# EAGLE design followers_v1 (EAGLE 9.5.0)

## Sheet 1 of 6: Input Amplifier
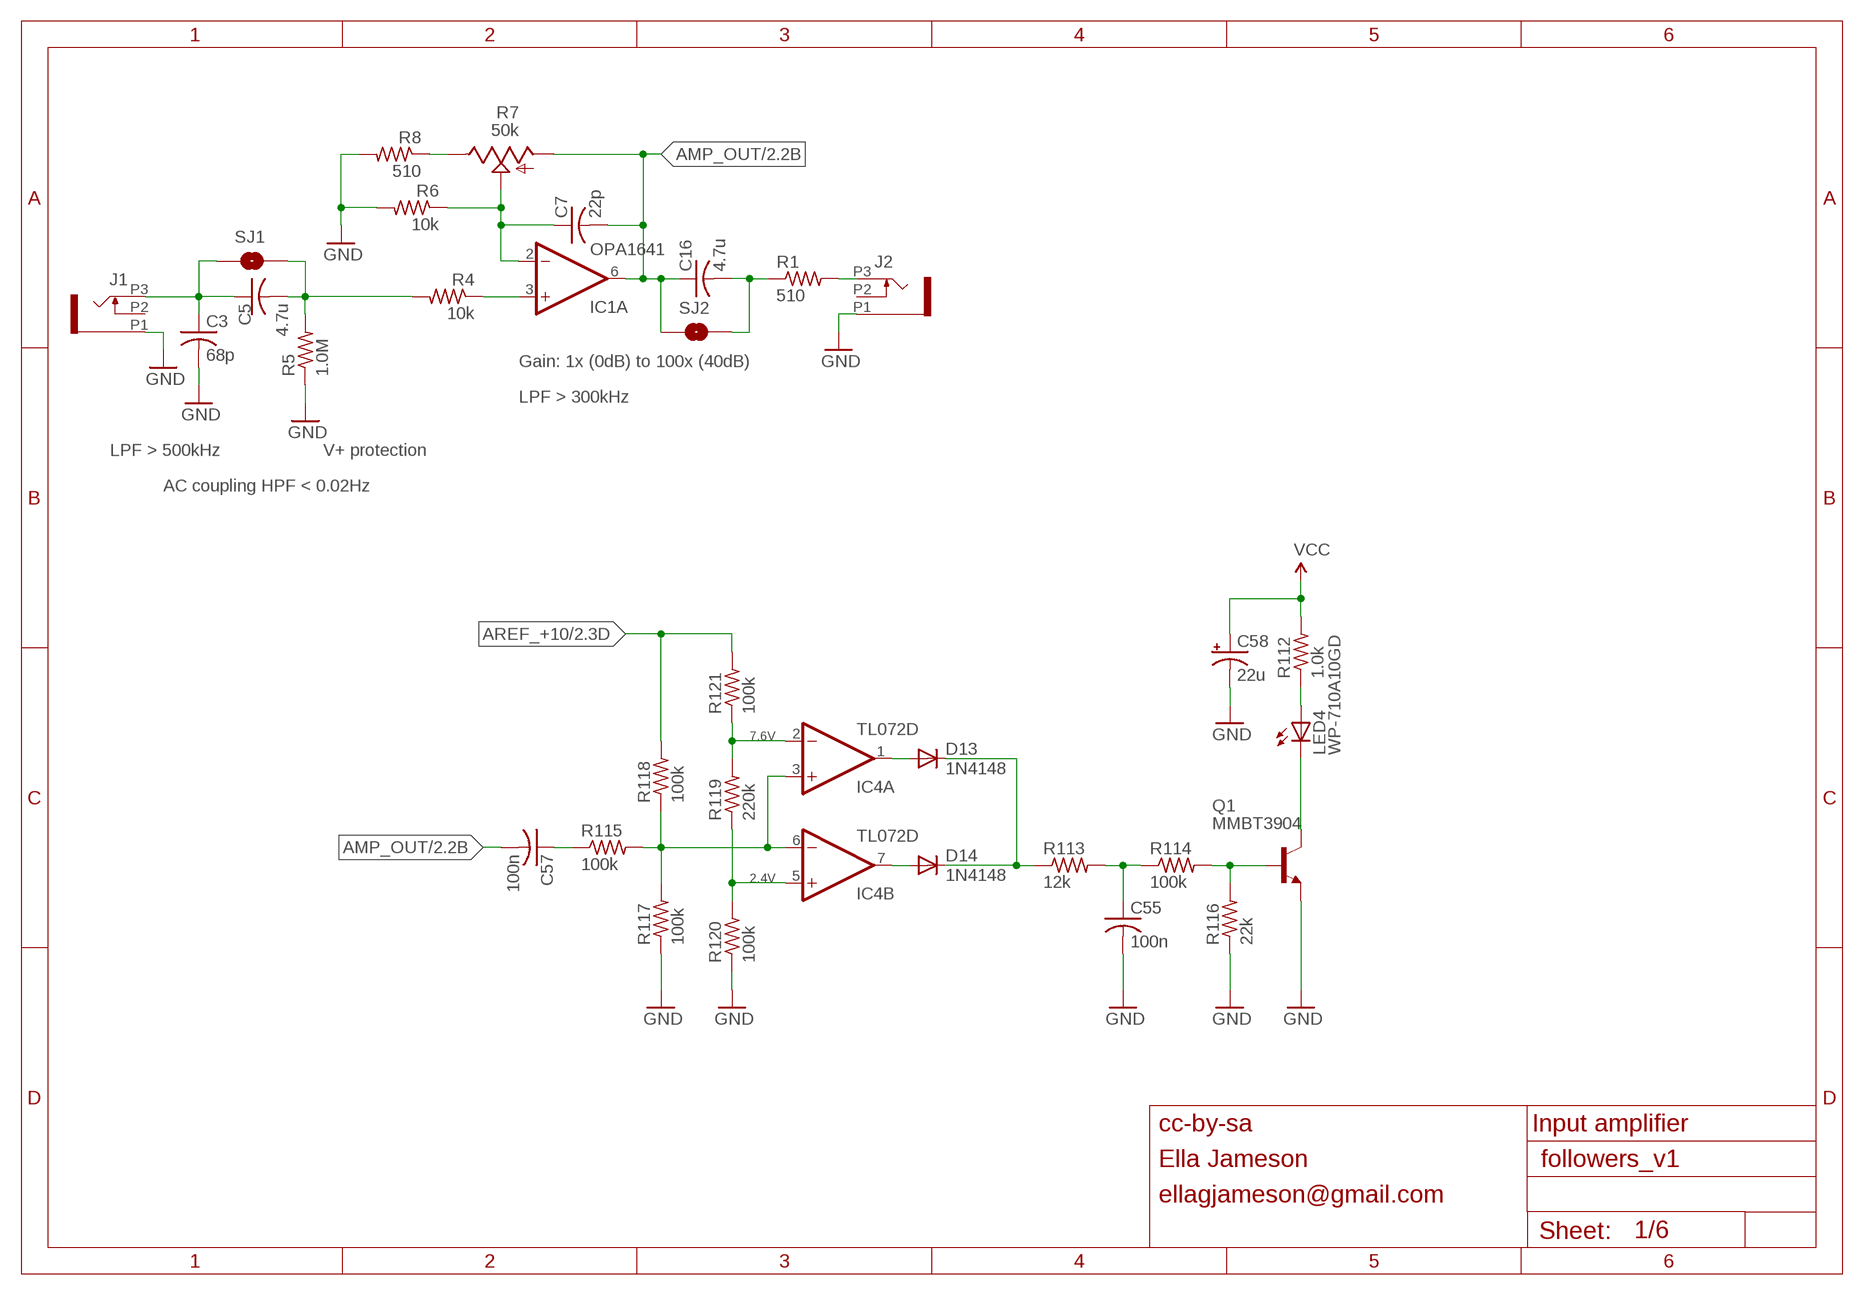
[diagram p0: schematic, sheet 1]

### Parts
C3  68p  C-USC0402  [C0402]
C5  4.7u  C-USC0603  [C0603]
C7  22p  C-USC0402  [C0402]
C16  4.7u  C-USC0603  [C0603]
C55  100n  C-USC0603  [C0603]
C57  100n  C-USC0603  [C0603]
C58  22u  CPOL-USC  [PANASONIC_C]
D13  1N4148  DIODE-SOD323-W  [SOD323-W]
D14  1N4148  DIODE-SOD323-W  [SOD323-W]
IC1  OPA1641  [MSOP8]
IC4  TL072D  [SO08]
J1  PJ301_THONKICONN6  [WQP_PJ_301M6]
J2  PJ301_THONKICONN6  [WQP_PJ_301M6]
LED4  WP-710A10GD  LED3MM  [LED3MM]
Q1  MMBT3904  MMBT3904LT1-NPN-SOT23-BEC  [SOT23-BEC]
R1  510  R-US_R0402  [R0402]
R4  10k  R-US_R0402  [R0402]
R5  1.0M  R-US_R0402  [R0402]
R6  10k  R-US_R0402  [R0402]
R7  50k  POT_USVERTICAL_PS  [ALPS_POT_VERTICAL_PS]
R8  510  R-US_R0402  [R0402]
R112  1.0k  R-US_R0603  [R0603]
R113  12k  R-US_R0603  [R0603]
R114  100k  R-US_R0603  [R0603]
R115  100k  R-US_R0603  [R0603]
R116  22k  R-US_R0603  [R0603]
R117  100k  R-US_R0603  [R0603]
R118  100k  R-US_R0603  [R0603]
R119  220k  R-US_R0603  [R0603]
R120  100k  R-US_R0603  [R0603]
R121  100k  R-US_R0603  [R0603]
SJ1  SOLDERJUMPERNC  [SJ_2S]
SJ2  SOLDERJUMPERNC  [SJ_2S]

### Nets
AMP_OUT: C7.2 C16.1 C57.2 IC1.6(A:OUT) R7.P$3(A) SJ2.1 ; also sheet 2
AREF_+10: R118.2 R121.2 ; also sheet 2,6
GND: C3.2 C55.2 C58.- J1.P1 J2.P1 Q1.E R5.1 R6.2 R8.2 R116.1 R117.1 R120.1 ; also sheet 2,3,4,5,6
N$2: IC1.3(A:+IN) R4.1
N$3: J2.P3 R1.2
N$4: C3.1 C5.1 J1.P3 SJ1.1
N$9: C7.1 IC1.2(A:-IN) R6.1 R7.P$2(S)
N$10: C5.2 R4.2 R5.2 SJ1.2
N$13: R7.P$1(E) R8.1
N$15: C16.2 R1.1 SJ2.2
N$60: LED4.K(C) Q1.C
N$94: C57.1 R115.1
N$96: IC4.3(A:+IN) IC4.6(B:-IN) R115.2 R117.2 R118.1
N$97: IC4.2(A:-IN) R119.2 R121.1
N$98: C55.1 R113.2 R114.1
N$99: IC4.5(B:+IN) R119.1 R120.2
N$100: D13.A IC4.1(A:OUT)
N$101: D14.A IC4.7(B:OUT)
N$102: D13.C D14.C R113.1
N$103: LED4.A R112.1
N$104: Q1.B R114.2 R116.2
VCC: C58.+ R112.2 ; also sheet 6
Unconnected: J1.P2 J2.P2

### Notes on the sheet
- Gain: 1x (0dB) to 100x (40dB)
- LPF > 300kHz
- LPF > 500kHz | V+ protection
- AC coupling HPF < 0.02Hz
- 7.6V
- 2.4V
- cc-by-sa | Input amplifier
- Ella Jameson
- ellagjameson@gmail.com

## Sheet 2 of 6: Full Wave Rectifier
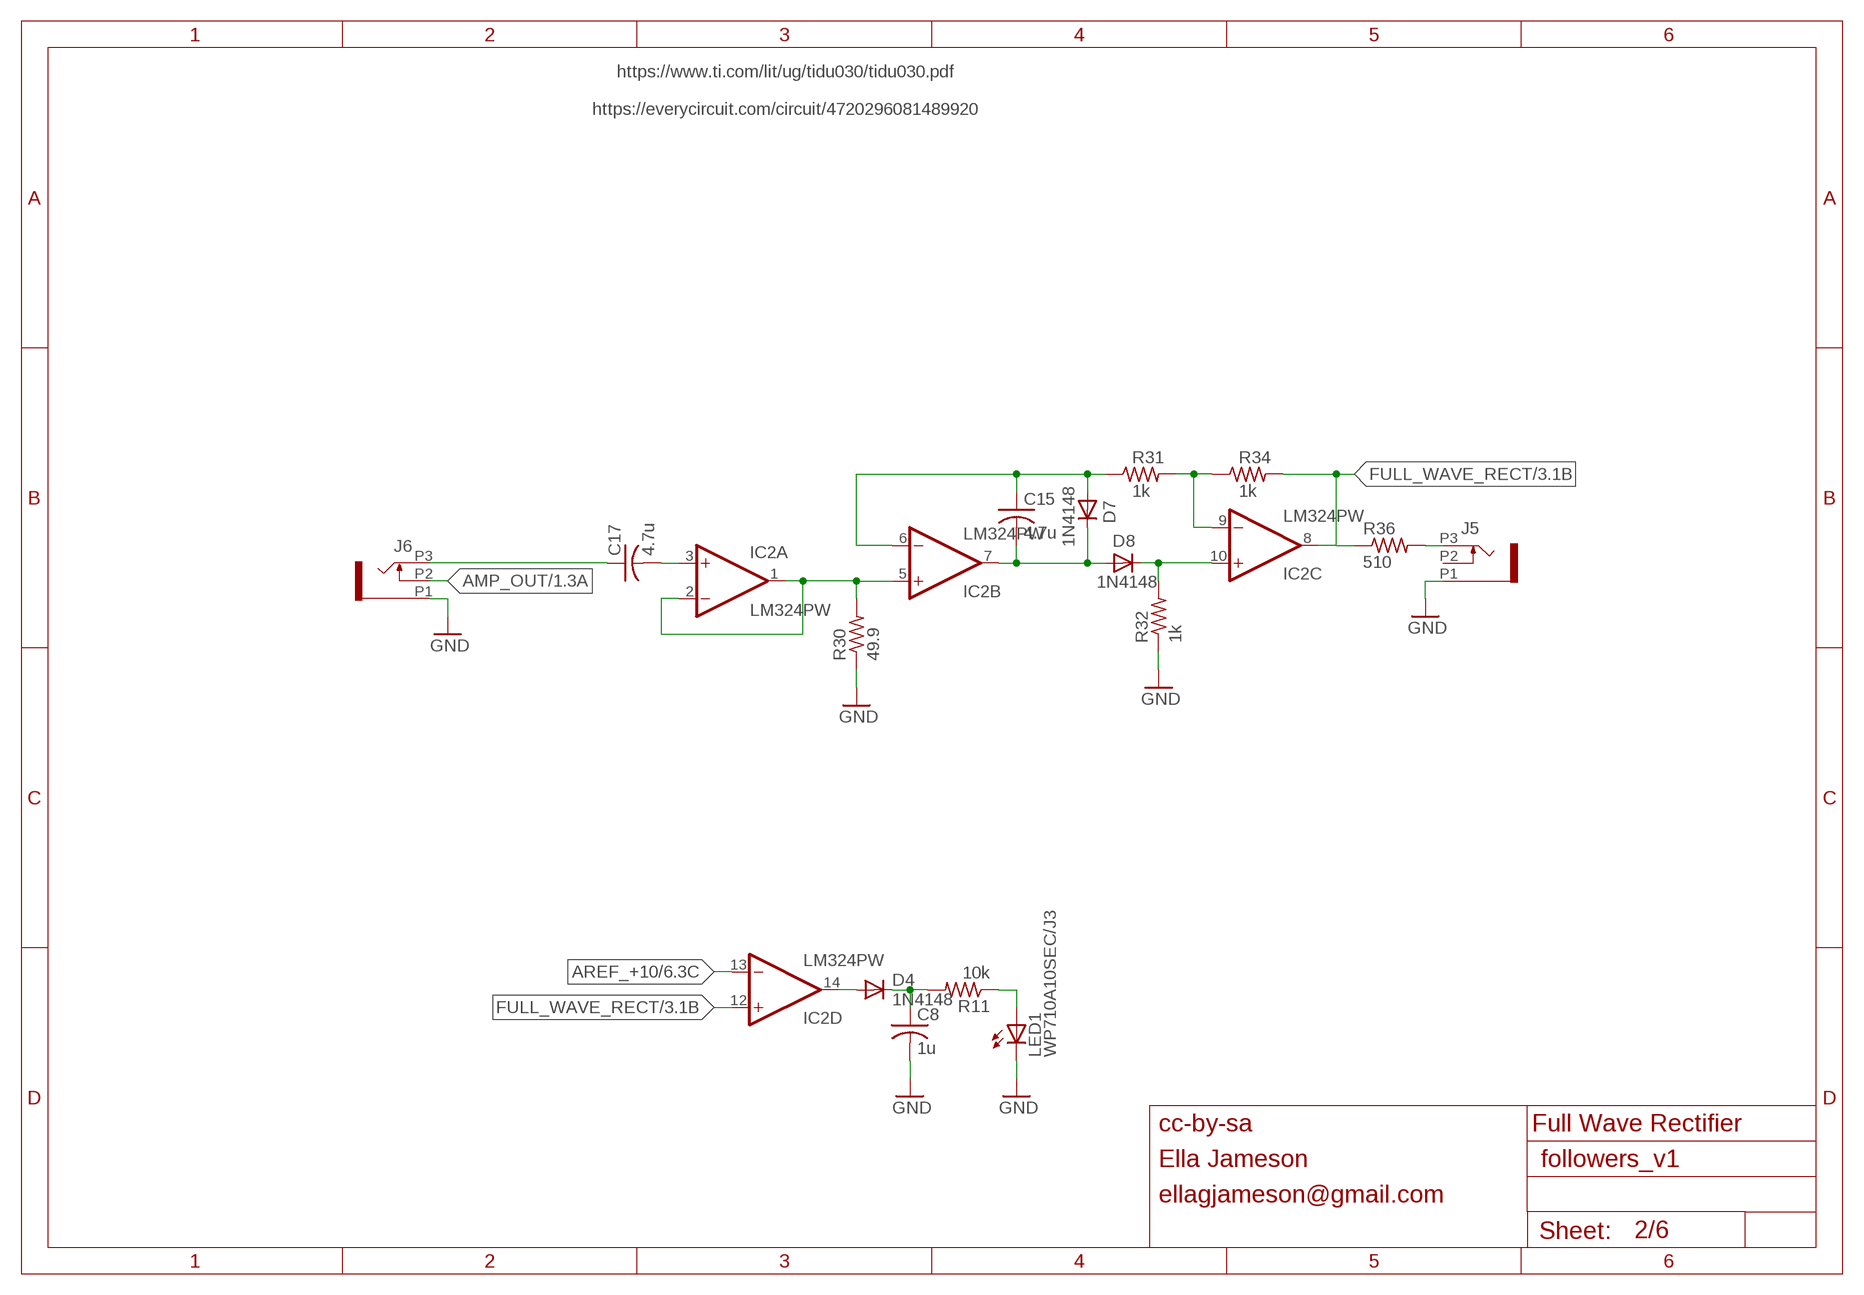
[diagram p1: schematic, sheet 2]

### Parts
C8  1u  C-USC0402  [C0402]
C15  4.7u  C-USC0603  [C0603]
C17  4.7u  C-USC0603  [C0603]
D4  1N4148  DIODE-SOD523  [SOD523]
D7  1N4148  DIODE-SOD523  [SOD523]
D8  1N4148  DIODE-SOD523  [SOD523]
IC2  LM324PW  [TSSOP14]
J5  PJ301_THONKICONN6  [WQP_PJ_301M6]
J6  PJ301_THONKICONN6  [WQP_PJ_301M6]
LED1  WP710A10SEC/J3  LED3MM  [LED3MM]
R11  10k  R-US_R0402  [R0402]
R30  49.9  R-US_R0402  [R0402]
R31  1k  R-US_R0402  [R0402]
R32  1k  R-US_R0402  [R0402]
R34  1k  R-US_R0402  [R0402]
R36  510  R-US_R0402  [R0402]

### Nets
AMP_OUT: J6.P2 ; also sheet 1
AREF_+10: IC2.13(D:-IN) ; also sheet 1,6
FULL_WAVE_RECT: IC2.8(C:OUT) IC2.12(D:+IN) R34.2 R36.1 ; also sheet 3
FWR_CLIP: D4.A IC2.14(D:OUT)
GND: C8.2 J5.P1 J6.P1 LED1.K(C) R30.1 R32.1 ; also sheet 1,3,4,5,6
N$5: C15.2 D7.C D8.A IC2.7(B:OUT)
N$7: J5.P3 R36.2
N$11: C15.1 D7.A IC2.6(B:-IN) R31.1
N$12: D8.C IC2.10(C:+IN) R32.2
N$14: IC2.9(C:-IN) R31.2 R34.1
N$27: C17.1 J6.P3
N$28: C8.1 D4.C R11.2
N$31: LED1.A R11.1
N$32: C17.2 IC2.3(A:+IN)
N$33: IC2.1(A:OUT) IC2.2(A:-IN) IC2.5(B:+IN) R30.2
Unconnected: J5.P2

### Notes on the sheet
- https://www.ti.com/lit/ug/tidu030/tidu030.pdf
  
  https://everycircuit.com/circuit/4720296081489920
- cc-by-sa | Full Wave Rectifier
- Ella Jameson
- ellagjameson@gmail.com

## Sheet 3 of 6: Slew Rate Limiter
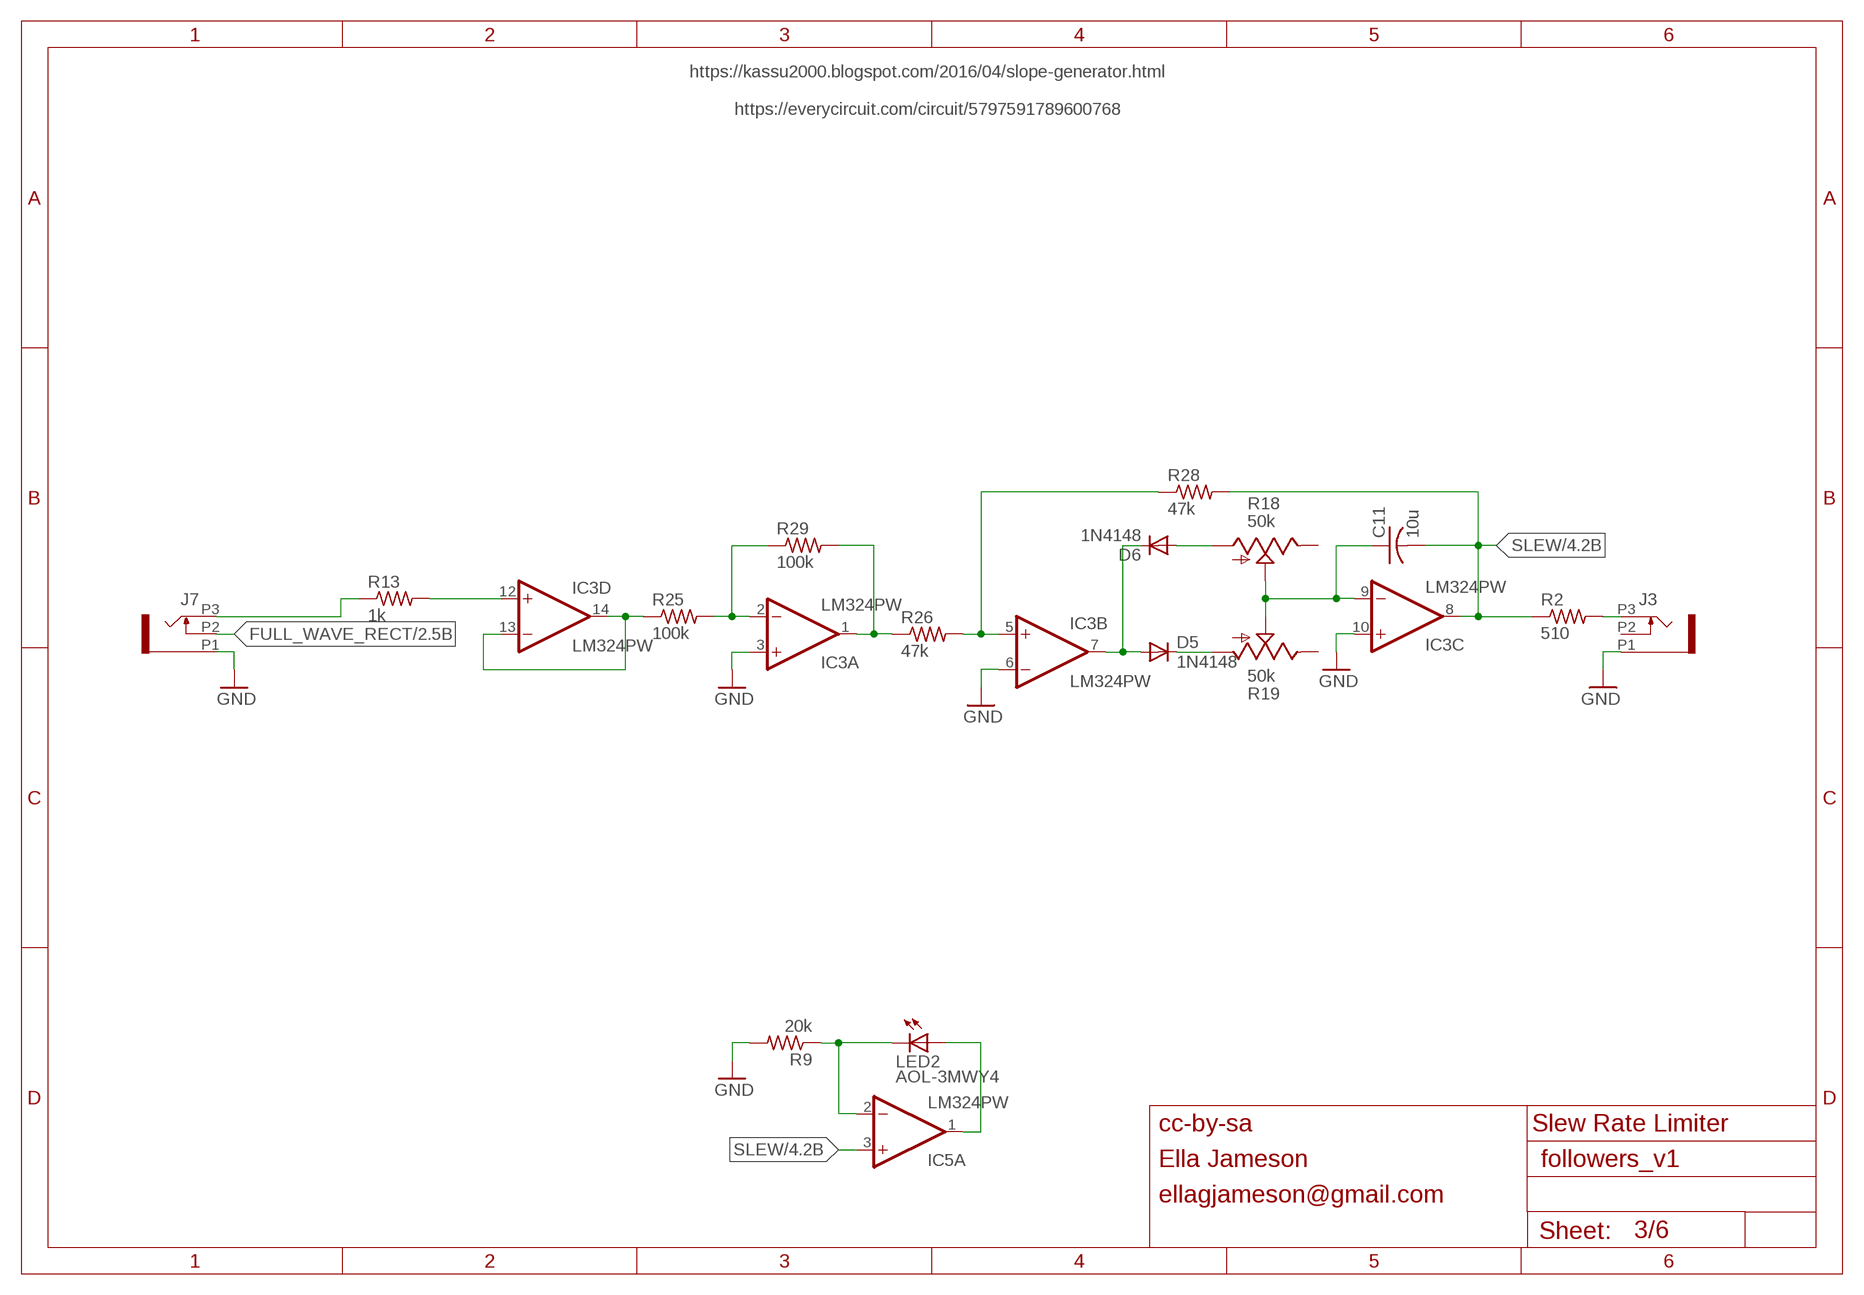
[diagram p2: schematic, sheet 3]

### Parts
C11  10u  C-USC0402  [C0402]
D5  1N4148  DIODE-SOD523  [SOD523]
D6  1N4148  DIODE-SOD523  [SOD523]
IC3  LM324PW  [TSSOP14]
IC5  LM324PW  [TSSOP14]
J3  PJ301_THONKICONN6  [WQP_PJ_301M6]
J7  PJ301_THONKICONN6  [WQP_PJ_301M6]
LED2  AOL-3MWY4  LED3MM  [LED3MM]
R2  510  R-US_R0402  [R0402]
R9  20k  R-US_R0402  [R0402]
R13  1k  R-US_R0402  [R0402]
R18  50k  POT_USVERTICAL_PS  [ALPS_POT_VERTICAL_PS]
R19  50k  POT_USVERTICAL_PS  [ALPS_POT_VERTICAL_PS]
R25  100k  R-US_R0402  [R0402]
R26  47k  R-US_R0402  [R0402]
R28  47k  R-US_R0402  [R0402]
R29  100k  R-US_R0402  [R0402]

### Nets
FULL_WAVE_RECT: J7.P2 ; also sheet 2
GND: IC3.3(A:+IN) IC3.6(B:-IN) IC3.10(C:+IN) J3.P1 J7.P1 R9.2 ; also sheet 1,2,4,5,6
N$1: J7.P3 R13.1
N$8: IC3.13(D:-IN) IC3.14(D:OUT) R25.1
N$16: J3.P3 R2.2
N$17: IC5.2(A:-IN) LED2.K(C) R9.1
N$18: IC3.2(A:-IN) R25.2 R29.1
N$19: IC3.1(A:OUT) R26.1 R29.2
N$21: IC3.5(B:+IN) R26.2 R28.1
N$23: D5.A D6.C IC3.7(B:OUT)
N$24: D5.C R19.P$3(A)
N$25: D6.A R18.P$3(A)
N$26: C11.1 IC3.9(C:-IN) R18.P$2(S) R19.P$2(S)
N$29: IC3.12(D:+IN) R13.2
N$30: IC5.1(A:OUT) LED2.A
SLEW: C11.2 IC3.8(C:OUT) IC5.3(A:+IN) R2.1 R28.2 ; also sheet 4
Unconnected: J3.P2 R18.P$1(E) R19.P$1(E)

### Notes on the sheet
- https://kassu2000.blogspot.com/2016/04/slope-generator.html
  
  https://everycircuit.com/circuit/5797591789600768
- cc-by-sa | Slew Rate Limiter
- Ella Jameson
- ellagjameson@gmail.com

## Sheet 4 of 6: Lowpass Filter
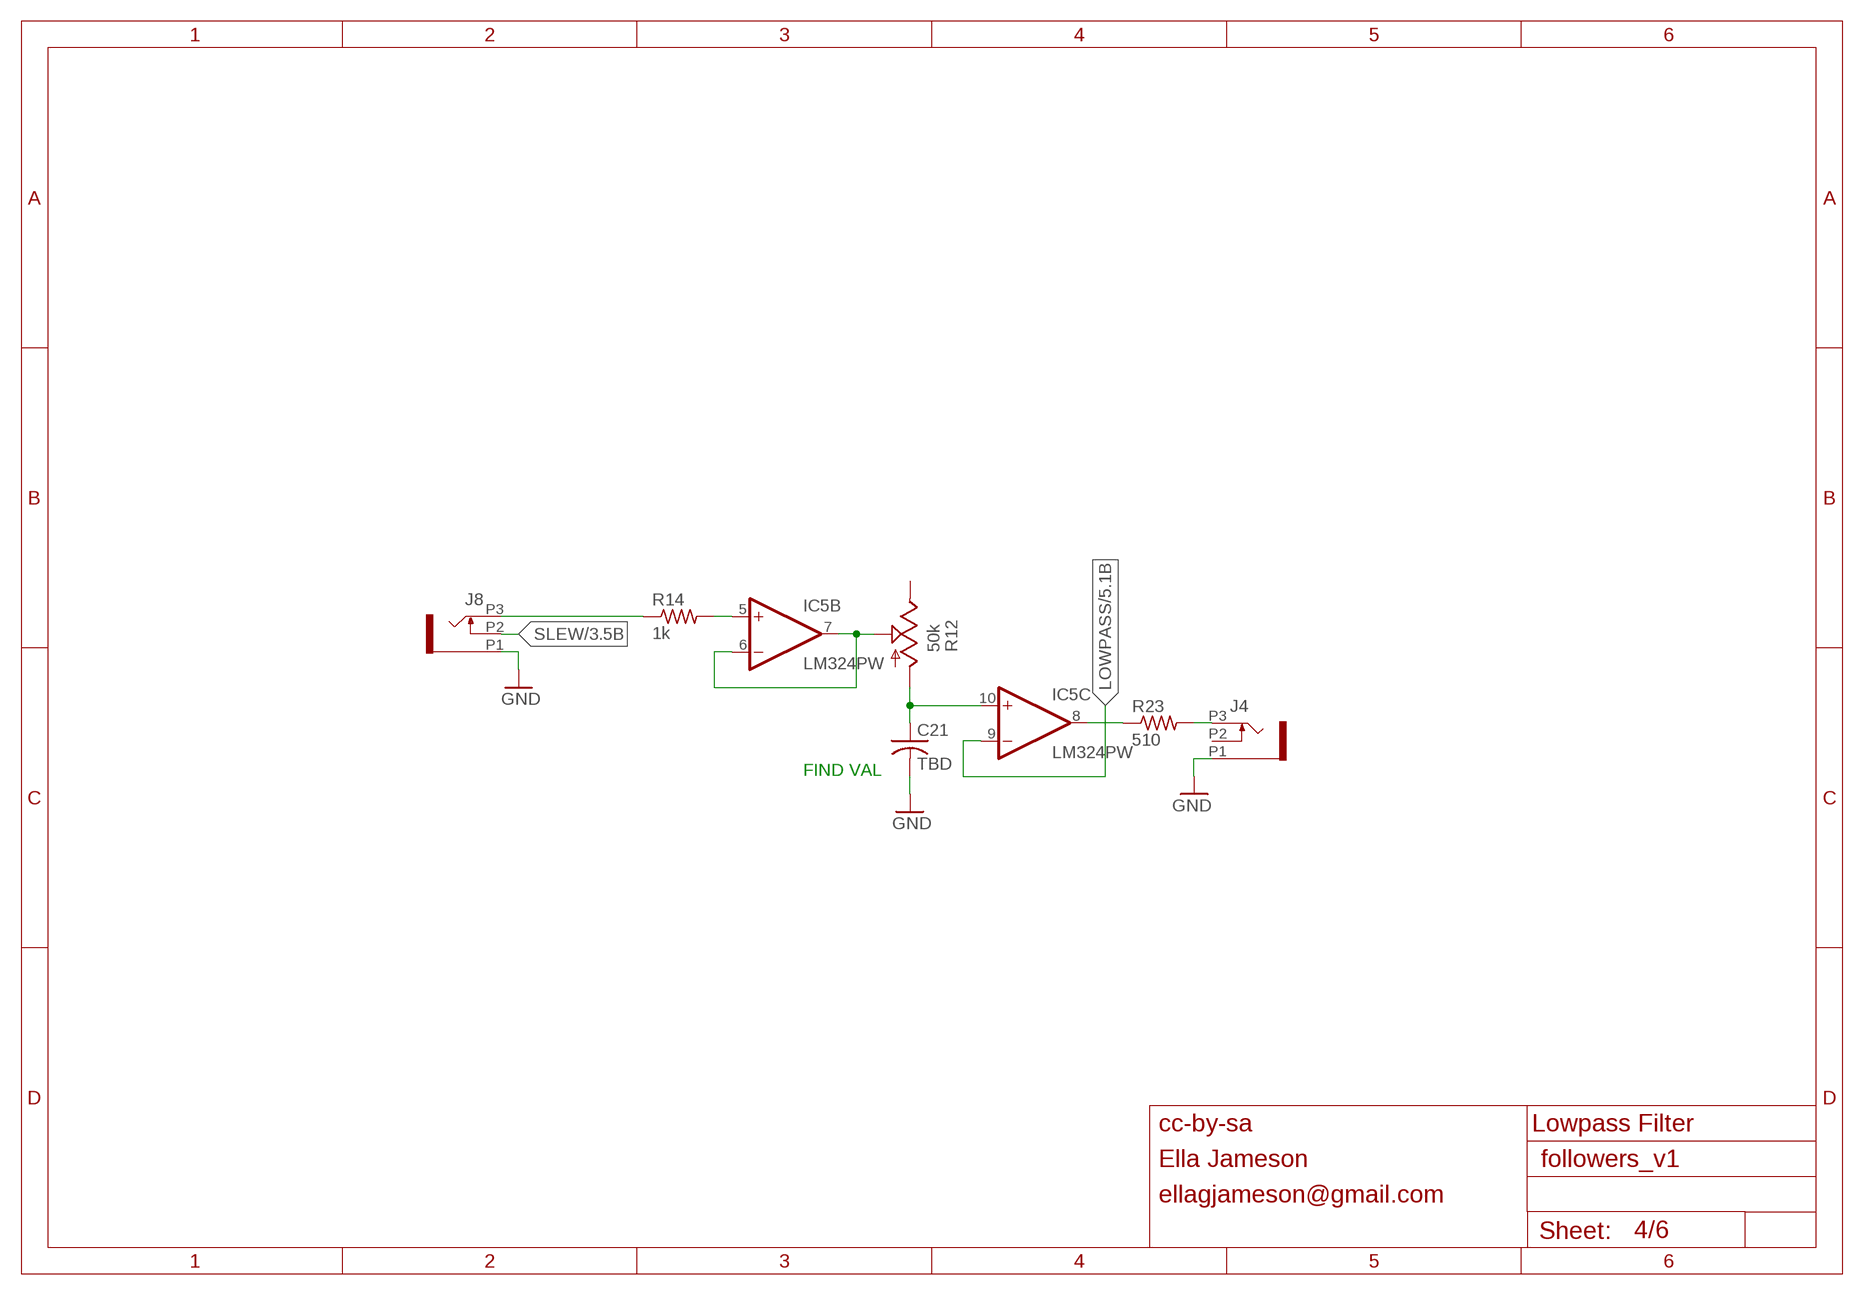
[diagram p3: schematic, sheet 4]

### Parts
C21  TBD  C-USC0402  [C0402]
J4  PJ301_THONKICONN6  [WQP_PJ_301M6]
J8  PJ301_THONKICONN6  [WQP_PJ_301M6]
R12  50k  POT_USVERTICAL_PS  [ALPS_POT_VERTICAL_PS]
R14  1k  R-US_R0402  [R0402]
R23  510  R-US_R0402  [R0402]

### Nets
GND: C21.2 J4.P1 J8.P1 ; also sheet 1,2,3,5,6
LOWPASS: IC5.8(C:OUT) IC5.9(C:-IN) R23.1 ; also sheet 5
N$35: C21.1 IC5.10(C:+IN) R12.P$3(A)
N$36: IC5.5(B:+IN) R14.2
N$39: J8.P3 R14.1
N$40: J4.P3 R23.2
N$43: IC5.6(B:-IN) IC5.7(B:OUT) R12.P$2(S)
SLEW: J8.P2 ; also sheet 3
Unconnected: J4.P2 R12.P$1(E)

### Notes on the sheet
- FIND VAL
- cc-by-sa | Lowpass Filter
- Ella Jameson
- ellagjameson@gmail.com

## Sheet 5 of 6: Comparator
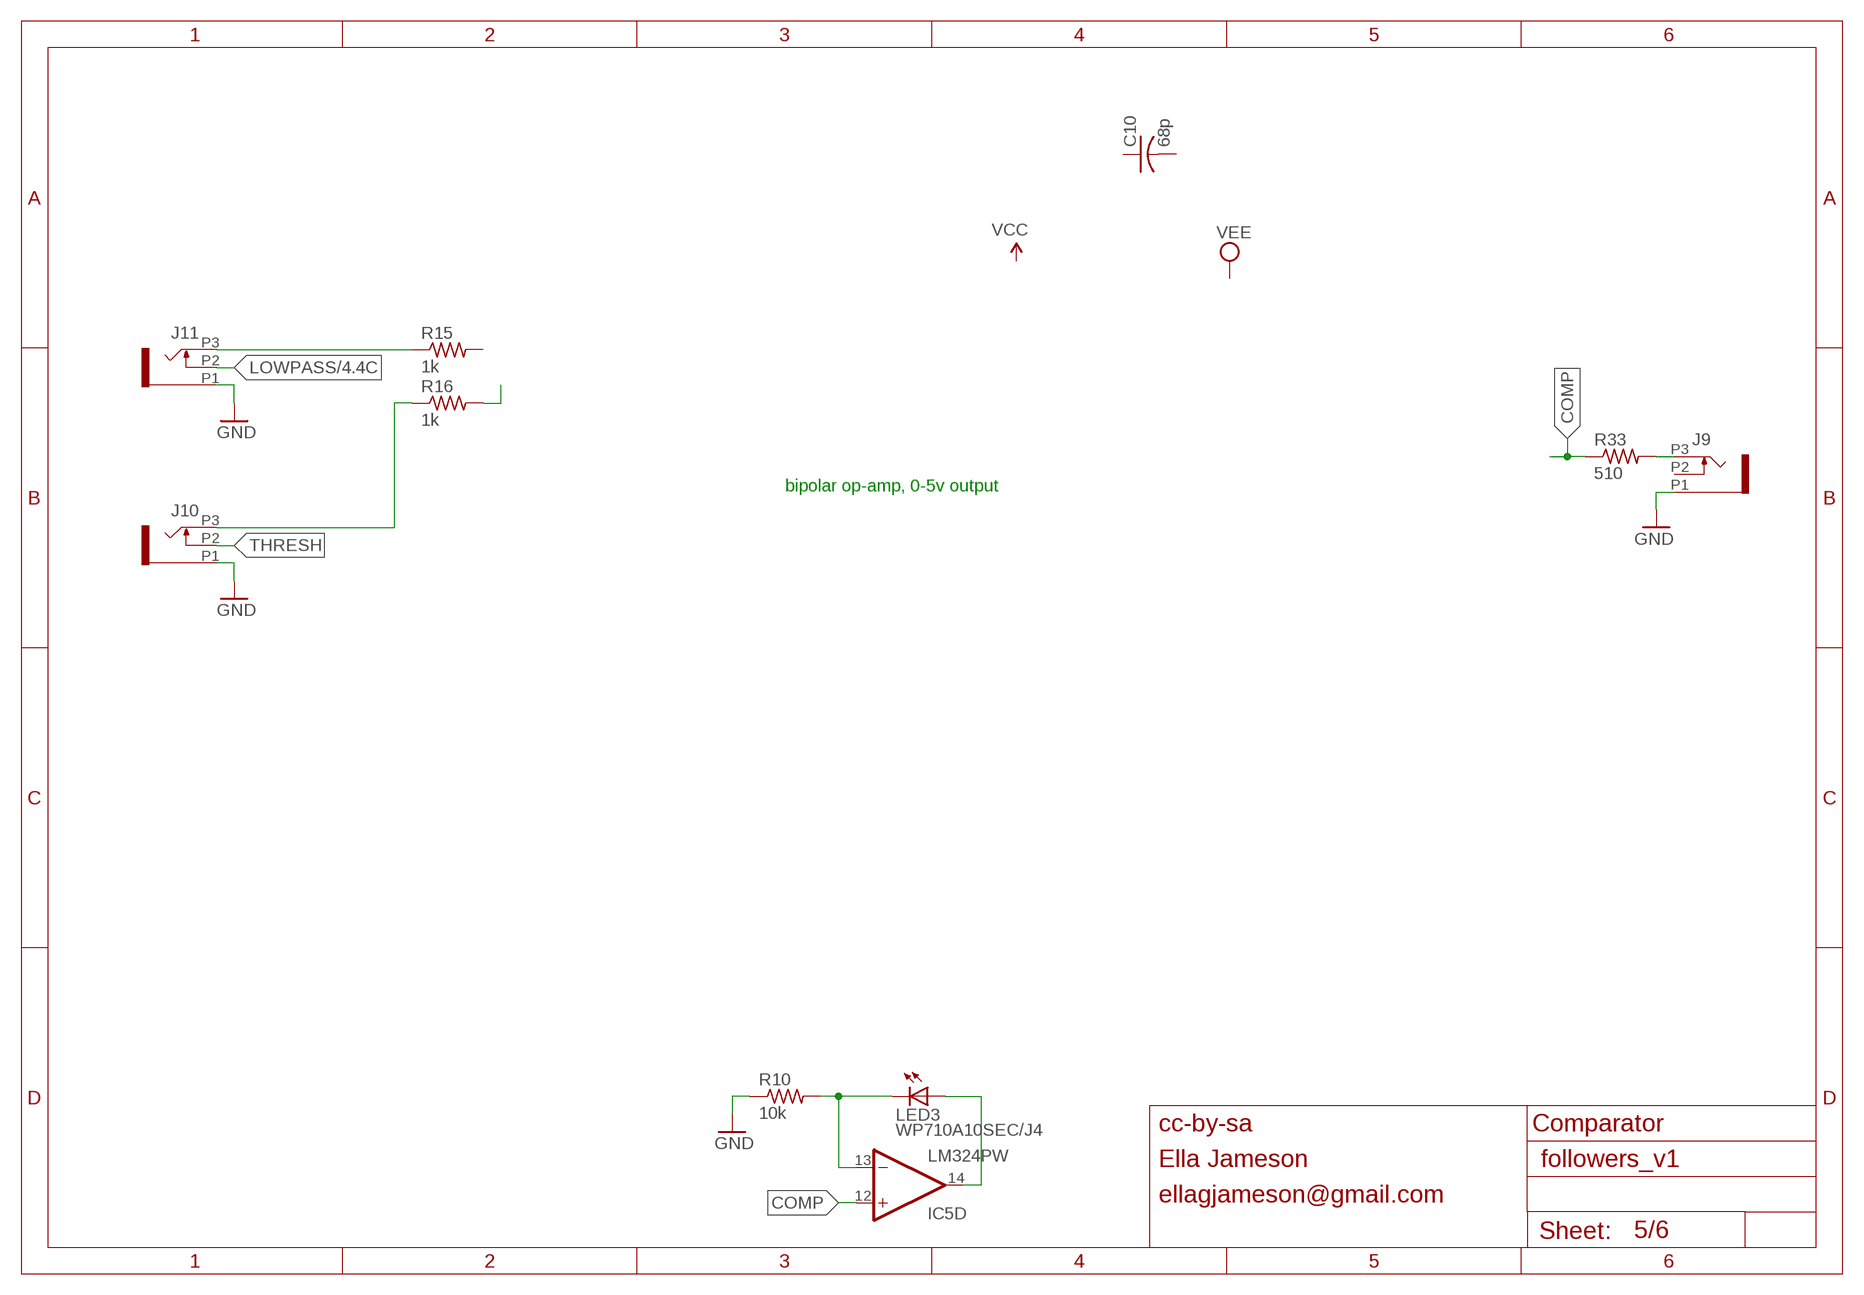
[diagram p4: schematic, sheet 5]

### Parts
C10  68p  C-USC0402  [C0402]
J9  PJ301_THONKICONN6  [WQP_PJ_301M6]
J10  PJ301_THONKICONN6  [WQP_PJ_301M6]
J11  PJ301_THONKICONN6  [WQP_PJ_301M6]
LED3  WP710A10SEC/J4  LED3MM  [LED3MM]
R10  10k  R-US_R0402  [R0402]
R15  1k  R-US_R0402  [R0402]
R16  1k  R-US_R0402  [R0402]
R33  510  R-US_R0402  [R0402]

### Nets
COMP: IC5.12(D:+IN) R33.1
GND: J9.P1 J10.P1 J11.P1 R10.1 ; also sheet 1,2,3,4,6
LOWPASS: J11.P2 ; also sheet 4
N$34: J9.P3 R33.2
N$37: IC5.13(D:-IN) LED3.K(C) R10.2
N$38: IC5.14(D:OUT) LED3.A
N$41: J11.P3 R15.1
N$42: J10.P3 R16.1
N$45: R16.2
THRESH: J10.P2
Unconnected: C10.1 C10.2 J9.P2 R15.2

### Notes on the sheet
- bipolar op-amp, 0-5v output
- cc-by-sa | Comparator
- Ella Jameson
- ellagjameson@gmail.com

## Sheet 6 of 6: Power Supply
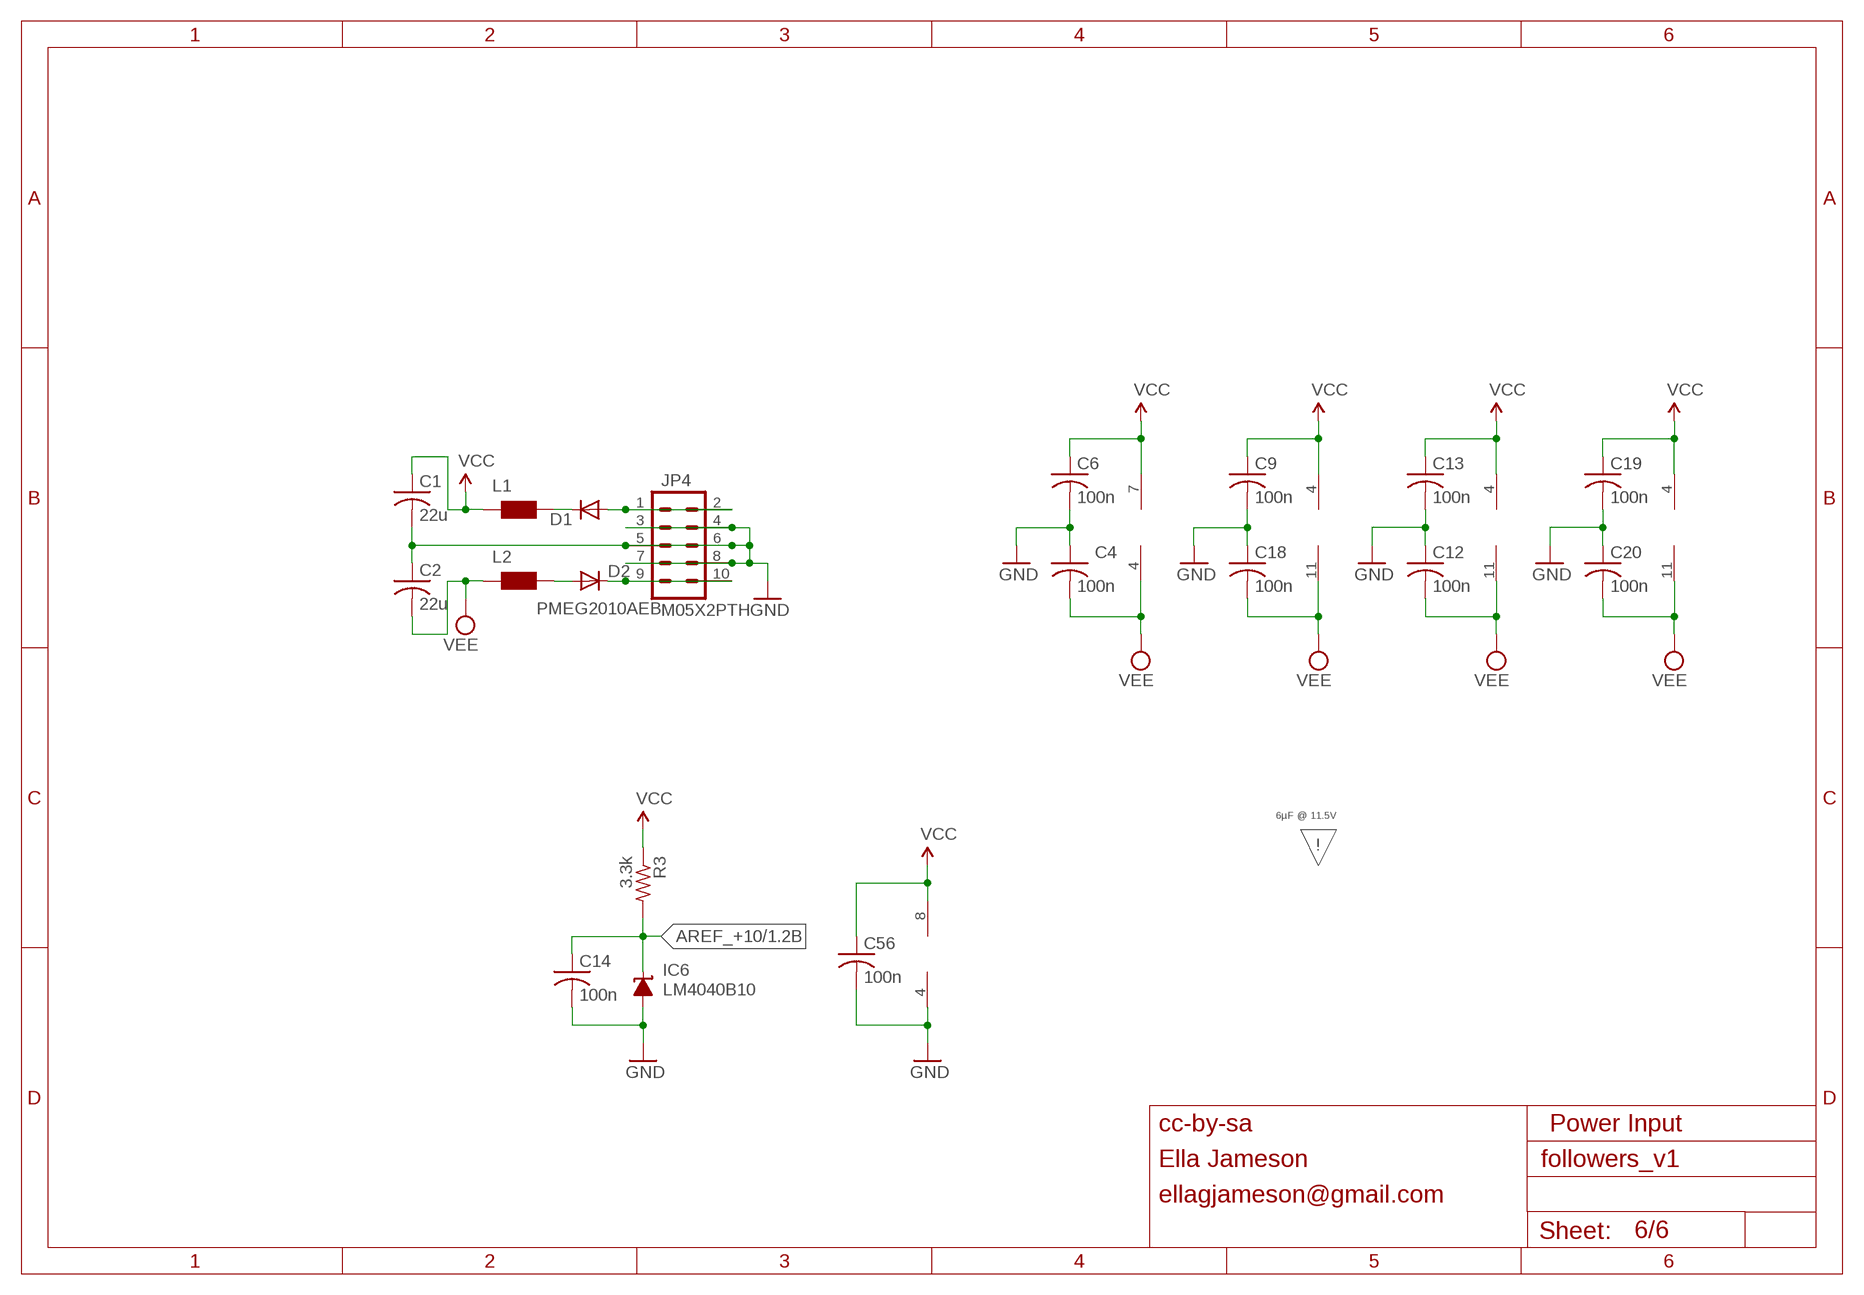
[diagram p5: schematic, sheet 6]

### Parts
C1  22u  C-USC1206  [C1206]
C2  22u  C-USC1206  [C1206]
C4  100n  C-USC0402  [C0402]
C6  100n  C-USC0402  [C0402]
C9  100n  C-USC0402  [C0402]
C12  100n  C-USC0402  [C0402]
C13  100n  C-USC0402  [C0402]
C14  100n  C-USC0603  [C0603]
C18  100n  C-USC0402  [C0402]
C19  100n  C-USC0402  [C0402]
C20  100n  C-USC0402  [C0402]
C56  100n  C-USC0603  [C0603]
D1  PMEG2010AEB  DIODE-SOD523  [SOD523]
D2  PMEG2010AEB  DIODE-SOD523  [SOD523]
IC6  LM4040B10  LM4041B12DBZ  [DBZ_R-PDSO-G3]
JP4  M05X2PTH  [AVR_ICSP]
L1  WE-CBF_0603  [0603]
L2  WE-CBF_0603  [0603]
R3  3.3k  R-US_R0603  [R0603]

### Nets
AREF_+10: C14.1 IC6.1(C) R3.2 ; also sheet 1,2
GND: C1.2 C2.1 C4.1 C6.2 C9.2 C12.1 C13.2 C14.2 C18.1 C19.2 C20.1 C56.2 IC4.4(P:V-) IC6.2(A) JP4.3 JP4.4 JP4.5 JP4.6 JP4.7 JP4.8 ; also sheet 1,2,3,4,5
N$6: D1.A JP4.1 JP4.2
N$20: D2.C JP4.9 JP4.10
N$22: D1.C L1.2
N$44: D2.A L2.2
VCC: C1.1 C6.1 C9.1 C13.1 C19.1 C56.1 IC1.7(V+) IC2.4(P:V+) IC3.4(P:V+) IC4.8(P:V+) IC5.4(P:V+) L1.1 R3.1 ; also sheet 1
VEE: C2.2 C4.2 C12.2 C18.2 C20.2 IC1.4(V-) IC2.11(P:V-) IC3.11(P:V-) IC5.11(P:V-) L2.1

### Notes on the sheet
- 6µF @ 11.5V
- !
- cc-by-sa | Power Input
- Ella Jameson
- ellagjameson@gmail.com

## Library data of the parts
C1-C21 C55-C57 = rcl:C-US: CAPACITOR, American symbol
C58 = rcl:CPOL-US: POLARIZED CAPACITOR, American symbol
D1 D2 D4-D8 D13 D14 = diode:DIODE-: DIODE
IC1 = og-ics:OPA1641
IC2 IC3 IC5 = og-ics:LM324: OP AMP
IC4 = og-linear:TL072: OP AMP
IC6 = texas:LM4041: PRECISION MICROPOWER SHUNT VOLTAGE REFERENCE Source: http://focus.ti.com/lit/ds/slcs146e/slcs146e.pdf
J1-J11 = og-pj301:PJ301_THONKICONN
JP4 = og-header:M05X2: Header 5x2 Standard 10-pin dual row 0.1" header. Commonly used with AVR-ISP. Use with Spark Fun Electronics SKU: PRT-00778
L1 L2 = wuerth-elektronik:WE-CBF: SMD EMI Suppression Ferrite Beads - excellent anti-EMI properties - low DCR - impedances till 3000 ohms - rated current up to 6 A
LED1-LED4 = led:LED: LED OSRAM: - CHIPLED LG R971, LG N971, LY N971, LG Q971, LY Q971, LO R971, LY R971 LH N974, LH R974 LS Q976, LO Q976, LY Q976 LO Q996 - Hyper CHIPLED LW Q18S LB Q993, LB Q99A, LB R99A - SideLED LS A670, LO A670, LY A670, LG A670, LP A670 LB A673, LV A673, LT A673, LW A673 LH A674 LY A675 LS A676, LA A676, LO A676, LY A676, LW A676 LS A679, LY A679, LG A679 - Hyper Micro SIDELED® LS Y876, LA Y876, LO Y876, LY Y876 LT Y87S - SmartLED LW L88C, LW L88S LB L89C, LB L89S, LG L890 LS L89K, LO L89K, LY L89K LS L896, LA L896, LO L896, LY L896 - TOPLED LS T670, LO T670, LY T670, LG T670, LP T670 LSG T670, LSP T670, LSY T670, LOP T670, LYG T670 LG T671, LOG T671, LSG T671 LB T673, LV T673, LT T673, LW T673 LH T674 LS T676, LA T676, LO T676, LY T676, LB T676, LH T676, LSB T676, LW T676 LB T67C, LV T67C, LT T67C, LS T67K, LO T67K, LY T67K, LW E67C LS E67B, LA E67B, LO E67B, LY E67B, LB E67C, LV E67C, LT E67C LW T67C LS T679, LY T679, LG T679 LS T770, LO T770, LY T770, LG T770, LP T770 LB T773, LV T773, LT T773, LW T773 LH T774 LS E675, LA E675, LY E675, LS T675 LS T776, LA T776, LO T776, LY T776, LB T776 LHGB T686 LT T68C, LB T68C - Hyper Mini TOPLED® LB M676 - Mini TOPLED Santana® LG M470 LS M47K, LO M47K, LY M47K Source: http://www.osram.convergy.de LUXEON: - LUMILED® LXK2-PW12-R00, LXK2-PW12-S00, LXK2-PW14-U00, LXK2-PW14-V00 LXK2-PM12-R00, LXK2-PM12-S00, LXK2-PM14-U00 LXK2-PE12-Q00, LXK2-PE12-R00, LXK2-PE12-S00, LXK2-PE14-T00, LXK2-PE14-U00 LXK2-PB12-K00, LXK2-PB12-L00, LXK2-PB12-M00, LXK2-PB14-N00, LXK2-PB14-P00, LXK2-PB14-Q00 LXK2-PR12-L00, LXK2-PR12-M00, LXK2-PR14-Q00, LXK2-PR14-R00 LXK2-PD12-Q00, LXK2-PD12-R00, LXK2-PD12-S00 LXK2-PH12-R00, LXK2-PH12-S00 LXK2-PL12-P00, LXK2-PL12-Q00, LXK2-PL12-R00 Source: www.luxeon.com KINGBRIGHT: KA-3528ASYC Source: www.kingbright.com
Q1 = transistor:*-NPN-: NPN Transistror BF959 corrected 2008.03.06
R1-R6 R8-R11 R13-R16 R23 R25 R26 R28-R34 R36 R112-R121 = rcl:R-US_: RESISTOR, American symbol
R7 R12 R18 R19 = og-pots:POT_US
SJ1 SJ2 = SparkFun:SOLDERJUMPER: Solder Jumper Standard SMD solder jumper. Used to automate production. Two varients : Normally Open and Normally Closed are the same, but have different paste layers. NC will have a large amount of paste and should jumper during reflow.

## Board
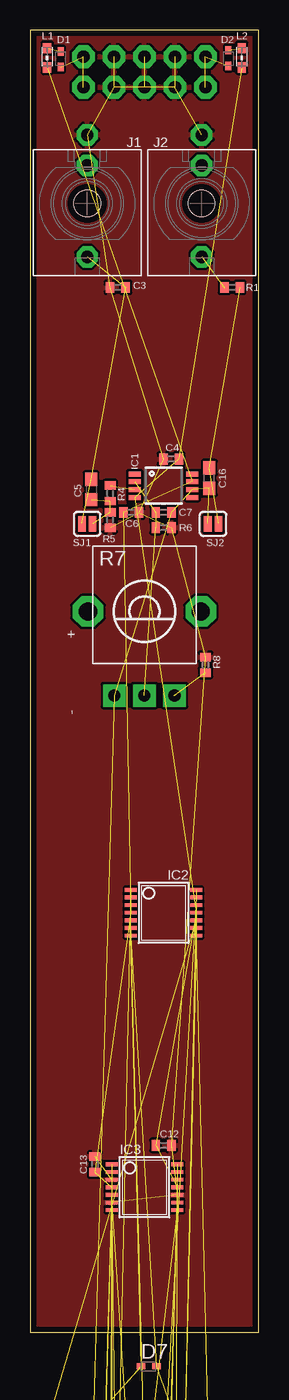
[diagram p6: board, top side]
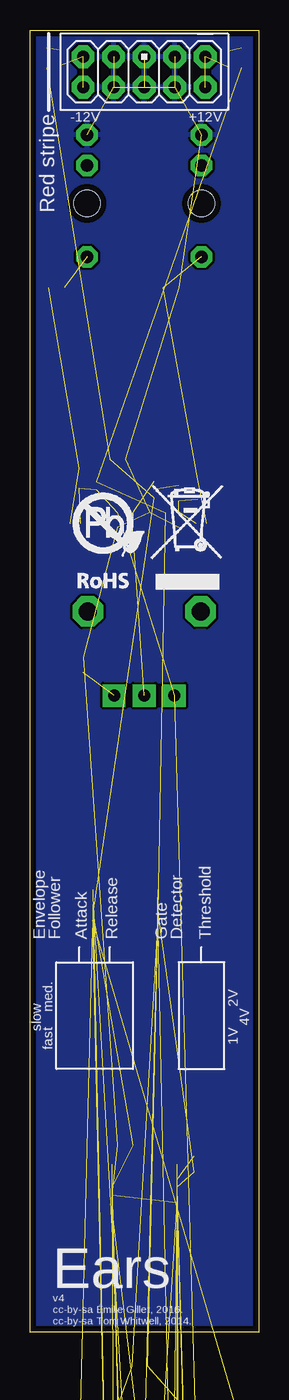
[diagram p7: board, bottom side, seen from below]

Size 19.03 x 108.43 mm. Coordinates in mm from the lower left corner, seen from the top.
Outline: 0,0 19.03,0 19.03,108.43 0,108.43 0,0
Copper layers (1*16): Top 0.035mm / dielectric 1.5mm / Bottom 0.035mm
Design rules "PCBCart-Standard *": minimum track width 8mil, minimum drill 0.4mm, track to track 8mil, track to pad 8mil, pad to pad 8mil, via to via 8mil, smd to smd 8mil, copper to edge 20mil, drill to drill 8mil, minimum pad ring 8mil, minimum via ring 10mil, stop-mask expansion 3mil, vias tented up to drill 25mil, thermal gap 8mil

### Footprints (pad centres in the part's own frame; a part is rotated, then mirrored left to right if it is on the bottom)
C1206 = smd 1.6 x 1.8: 1 -1.4,0; 2 1.4,0
C0402 = smd 0.7 x 0.9: 1 -0.65,0; 2 0.65,0
C0603 = smd 1.1 x 1: 1 -0.85,0; 2 0.85,0
PANASONIC_C = smd 2.6 x 1.4: + 2.05,0; - -2.05,0
SOD523 = smd 0.7 x 0.5: A 0.7,0; C -0.6,0
SOD323-W = smd 1.5 x 1.2: A 1.45,0; C -1.45,0
MSOP8 = smd 0.41 x 1.02: 1 -0.975,-2.4; 2 -0.325,-2.4; 3 0.325,-2.4; 4 0.975,-2.4; 5 0.975,2.4; 6 0.325,2.4; 7 -0.325,2.4; 8 -0.975,2.4
TSSOP14 = smd 0.305 x 0.991: 1 -1.905,-2.718; 2 -1.27,-2.718; 3 -0.635,-2.718; 4 0,-2.718; 5 0.635,-2.718; 6 1.27,-2.718; 7 1.905,-2.718; 8 1.905,2.718; 9 1.27,2.718; 10 0.635,2.718; 11 0,2.718; 12 -0.635,2.718; 13 -1.27,2.718; 14 -1.905,2.718
SO08 = smd 0.6 x 2.2: 1 -1.905,-2.6; 2 -0.635,-2.6; 3 0.635,-2.6; 4 1.905,-2.6; 5 1.905,2.6; 6 0.635,2.6; 7 -0.635,2.6; 8 -1.905,2.6
DBZ_R-PDSO-G3 = smd 0.7 x 1: 1 -0.95,-1.1; 2 0.95,-1.1; 3 0,1.1
WQP_PJ_301M6 = drill 1.016 pad 1.778 octagon: P1 0,-5.715; P2 0,-3.175; P3 0,4.445 | hole 2.2: 0,0
AVR_ICSP = drill 1.016 pad 1.88 octagon: 1 -1.27,5.08; 2 1.27,5.08; 3 -1.27,2.54; 4 1.27,2.54; 5 -1.27,0; 6 1.27,0; 7 -1.27,-2.54; 8 1.27,-2.54; 9 -1.27,-5.08; 10 1.27,-5.08
0603 = smd 0.85 x 0.7: 1 -0.9,0; 2 0.7,0
LED3MM = drill 0.813 octagon: A -1.27,0; K 1.27,0
SOT23-BEC = smd 1 x 1.4: B -0.95,-1.1; C 0,1.1; E 0.95,-1.1
R0402 = smd 0.7 x 0.9: 1 -0.65,0; 2 0.65,0
R0603 = smd 1 x 1.1: 1 -0.85,0; 2 0.85,0
ALPS_POT_VERTICAL_PS = drill 1 pad 1.88 square: P$1 -2.5,7; P$2 0,7; P$3 2.5,7 | drill 1.5 pad 2.54 octagon: P$4 -4.7,0; P$5 4.7,0
SJ_2S = smd 0.635 x 1.27: 1 -0.45,0; 2 0.45,0

### Placement (x,y rotation side)
C1  1.91,-280.35 0 top  (outside the outline)
C2  1.91,-286.7 0 top  (outside the outline)
C3  7.3,87 180 top
C4  11.75,72.71 0 top
C5  5.08,70.17 270 top
C6  8.41,68.26 0 top
C7  11.11,68.26 0 top
C8  0.95,-147.96 0 top  (outside the outline)
C9  0.64,-297.5 0 top  (outside the outline)
C10  0.64,-379.41 0 top  (outside the outline)
C11  5.71,-228.28 0 top  (outside the outline)
C12  11.11,15.56 180 top
C13  5.4,13.97 90 top
C14  0.95,-199.39 0 top  (outside the outline)
C15  11.75,-21.59 0 top  (outside the outline)
C16  14.92,71.12 90 top
C17  0.64,-292.42 0 top  (outside the outline)
C18  0.64,-302.58 0 top  (outside the outline)
C19  0.64,-406.72 0 top  (outside the outline)
C20  0.64,-411.8 0 top  (outside the outline)
C21  0.64,-421.96 0 top  (outside the outline)
C55  6.67,-182.25 0 top  (outside the outline)
C56  12.06,-182.25 0 top  (outside the outline)
C57  17.46,-182.25 0 top  (outside the outline)
C58  11.75,-159.38 0 top  (outside the outline)
D1  2.54,106.05 270 top
D2  16.51,106.05 90 top
D4  9.53,-134.3 0 top  (outside the outline)
D5  8.89,-213.04 0 top  (outside the outline)
D6  0.64,-218.12 0 top  (outside the outline)
D7  9.84,-2.86 0 top
D8  0.95,-11.43 0 top  (outside the outline)
D13  1.59,-166.69 0 top  (outside the outline)
D14  9.84,-166.69 0 top  (outside the outline)
IC1  11.11,70.48 270 top
IC2  11.11,34.92 270 top
IC3  9.53,12.06 270 top
IC4  3.81,-160.02 0 top  (outside the outline)
IC5  3.49,-400.69 0 top  (outside the outline)
IC6  1.91,-193.04 0 top  (outside the outline)
J1  4.76,93.98 180 top
J2  14.29,93.98 180 top
J3  3.81,-80.64 0 top  (outside the outline)
J4  3.81,-351.79 0 top  (outside the outline)
J5  4.45,-32.38 0 top  (outside the outline)
J6  3.81,-54.61 0 top  (outside the outline)
J7  3.81,-67.63 0 top  (outside the outline)
J8  3.81,-338.77 0 top  (outside the outline)
J9  3.81,-111.76 0 top  (outside the outline)
J10  3.81,-124.78 0 top  (outside the outline)
J11  3.81,-369.89 0 top  (outside the outline)
JP4  9.53,104.93 270 bottom
L1  1.43,106.2 90 top
L2  17.62,106.2 90 top
LED1  1.59,-152.72 0 top  (outside the outline)
LED2  1.27,-246.7 0 top  (outside the outline)
LED3  1.27,-274.95 0 top  (outside the outline)
LED4  1.59,-187.01 0 top  (outside the outline)
Q1  17.78,-158.75 0 top  (outside the outline)
R1  16.83,87 180 top
R2  0.95,-90.17 0 top  (outside the outline)
R3  6.35,-199.39 0 top  (outside the outline)
R4  6.67,69.85 270 top
R5  6.67,67.63 90 top
R6  11.11,66.99 0 top
R7  9.53,60.01 180 top
R8  14.61,55.56 90 top
R9  0.64,-241.94 0 top  (outside the outline)
R10  5.4,-270.19 0 top  (outside the outline)
R11  11.11,-142.88 0 top  (outside the outline)
R12  5.4,-389.89 0 top  (outside the outline)
R13  0.64,-416.88 0 top  (outside the outline)
R14  0.64,-427.04 0 top  (outside the outline)
R15  0.64,-432.12 0 top  (outside the outline)
R16  0.64,-437.2 0 top  (outside the outline)
R18  5.4,-313.06 0 top  (outside the outline)
R19  5.4,-327.02 0 top  (outside the outline)
R23  0.64,-361.31 0 top  (outside the outline)
R25  11.75,-223.2 0 top  (outside the outline)
R26  0.95,-228.28 0 top  (outside the outline)
R28  0.95,-223.2 0 top  (outside the outline)
R29  6.35,-223.2 0 top  (outside the outline)
R30  8.89,-11.43 0 top  (outside the outline)
R31  14.29,-11.43 0 top  (outside the outline)
R32  1.27,-16.51 0 top  (outside the outline)
R33  10.48,-108.27 0 top  (outside the outline)
R34  12.06,-16.51 0 top  (outside the outline)
R36  6.67,-41.91 0 top  (outside the outline)
R112  6.67,-172.09 0 top  (outside the outline)
R113  12.38,-172.09 0 top  (outside the outline)
R114  18.1,-172.09 0 top  (outside the outline)
R115  0.95,-177.16 0 top  (outside the outline)
R116  6.67,-177.16 0 top  (outside the outline)
R117  12.38,-177.16 0 top  (outside the outline)
R118  18.1,-177.16 0 top  (outside the outline)
R119  0.95,-182.25 0 top  (outside the outline)
R120  17.14,-166.37 0 top  (outside the outline)
R121  0.95,-172.09 0 top  (outside the outline)
SJ1  4.76,67.31 0 top
SJ2  15.24,67.31 0 top
U$2  [ROHS]  16.35,61.28 0 bottom

### Tracks (layer width: path | path; a pad name or v marks a point on that pad's centre or on a via)
AMP_OUT  (6 unrouted)
AREF_+10  (5 unrouted)
COMP  (1 unrouted)
FULL_WAVE_RECT  (4 unrouted)
FWR_CLIP  (1 unrouted)
GND  (50 unrouted)
  pour Bottom: 0,108.43 0,0 19.05,0 19.05,108.43
  pour Top: 0,108.43 0,0 19.05,0 19.05,108.43
LOWPASS  (3 unrouted)
N$1  (1 unrouted)
N$2  (1 unrouted)
N$3  (1 unrouted)
N$4  (3 unrouted)
N$5  (3 unrouted)
N$6  (2 unrouted)
N$7  (1 unrouted)
N$8  (2 unrouted)
N$9  (3 unrouted)
N$10  (3 unrouted)
N$11  (3 unrouted)
N$12  (2 unrouted)
N$13  (1 unrouted)
N$14  (2 unrouted)
N$15  (2 unrouted)
N$16  (1 unrouted)
N$17  (2 unrouted)
N$18  (2 unrouted)
N$19  (2 unrouted)
N$20  (2 unrouted)
N$21  (2 unrouted)
N$22  (1 unrouted)
N$23  (2 unrouted)
N$24  (1 unrouted)
N$25  (1 unrouted)
N$26  (3 unrouted)
N$27  (1 unrouted)
N$28  (2 unrouted)
N$29  (1 unrouted)
N$30  (1 unrouted)
N$31  (1 unrouted)
N$32  (1 unrouted)
N$33  (3 unrouted)
N$34  (1 unrouted)
N$35  (2 unrouted)
N$36  (1 unrouted)
N$37  (2 unrouted)
N$38  (1 unrouted)
N$39  (1 unrouted)
N$40  (1 unrouted)
N$41  (1 unrouted)
N$42  (1 unrouted)
N$43  (2 unrouted)
N$44  (1 unrouted)
N$60  (1 unrouted)
N$94  (1 unrouted)
N$96  (4 unrouted)
N$97  (2 unrouted)
N$98  (2 unrouted)
N$99  (2 unrouted)
N$100  (1 unrouted)
N$101  (1 unrouted)
N$102  (2 unrouted)
N$103  (1 unrouted)
N$104  (2 unrouted)
SLEW  (5 unrouted)
VCC  (14 unrouted)
VEE  (9 unrouted)

### Text on the board
tPlace: + | -
bPlace: Red stripe | Threshold | Detector | Gate | Release | Attack | Follower | Envelope | 2V | 4V | med. | 1V | slow | fast
bNames: +12V | -12V | Ears | v4 | cc-by-sa Émilie Gillet, 2016. | cc-by-sa Tom Whitwell, 2014.
tDocu: DC IN | DC OUT